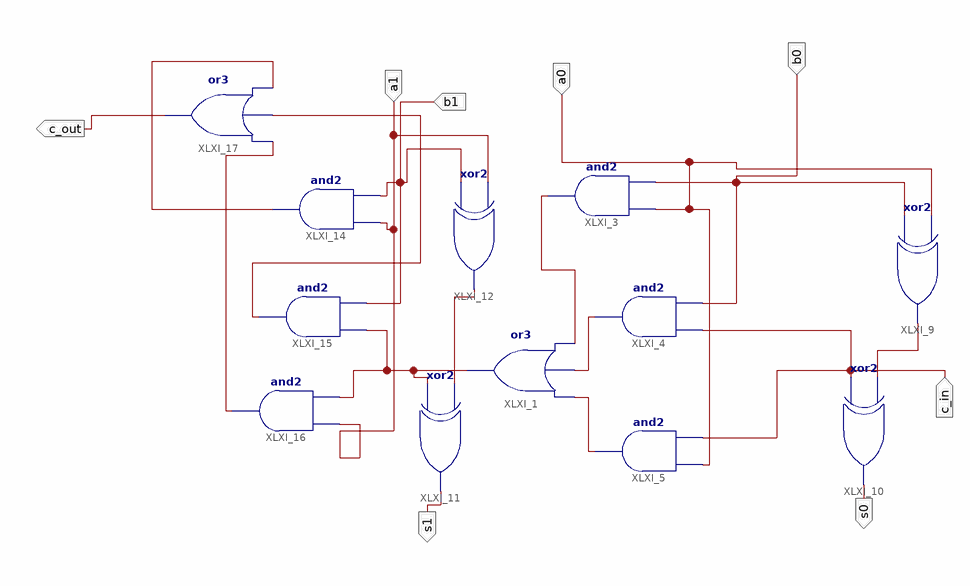
[diagram p0: schematic sheet 1]
// Xilinx ISE schematic Adder_2bits_schematic.sch (spartan3e) as structural Verilog: 12 symbols, 8 ports
module Adder_2bits_schematic (
  input  a0,
  input  b0,
  input  c_in,
  input  a1,
  input  b1,
  output c_out,
  output s1,
  output s0
);

  wire XLXN_6, XLXN_9, XLXN_10, XLXN_11, XLXN_16, XLXN_17, XLXN_18, XLXN_19, XLXN_20;

  or XLXI_1 (XLXN_16, XLXN_9, XLXN_10, XLXN_11);
  and XLXI_3 (XLXN_9, b0, a0);
  and XLXI_4 (XLXN_10, b0, c_in);
  and XLXI_5 (XLXN_11, c_in, a0);
  xor XLXI_9 (XLXN_6, b0, a0);
  xor XLXI_10 (s0, c_in, XLXN_6);
  xor XLXI_11 (s1, XLXN_16, XLXN_17);
  and XLXI_14 (XLXN_18, b1, a1);
  and XLXI_15 (XLXN_19, b1, XLXN_16);
  and XLXI_16 (XLXN_20, XLXN_16, a1);
  or XLXI_17 (c_out, XLXN_18, XLXN_19, XLXN_20);
  xor XLXI_12 (XLXN_17, b1, a1);
endmodule
